# EAGLE design led projek (EAGLE 9.6.2)

## Sheet 1 of 2
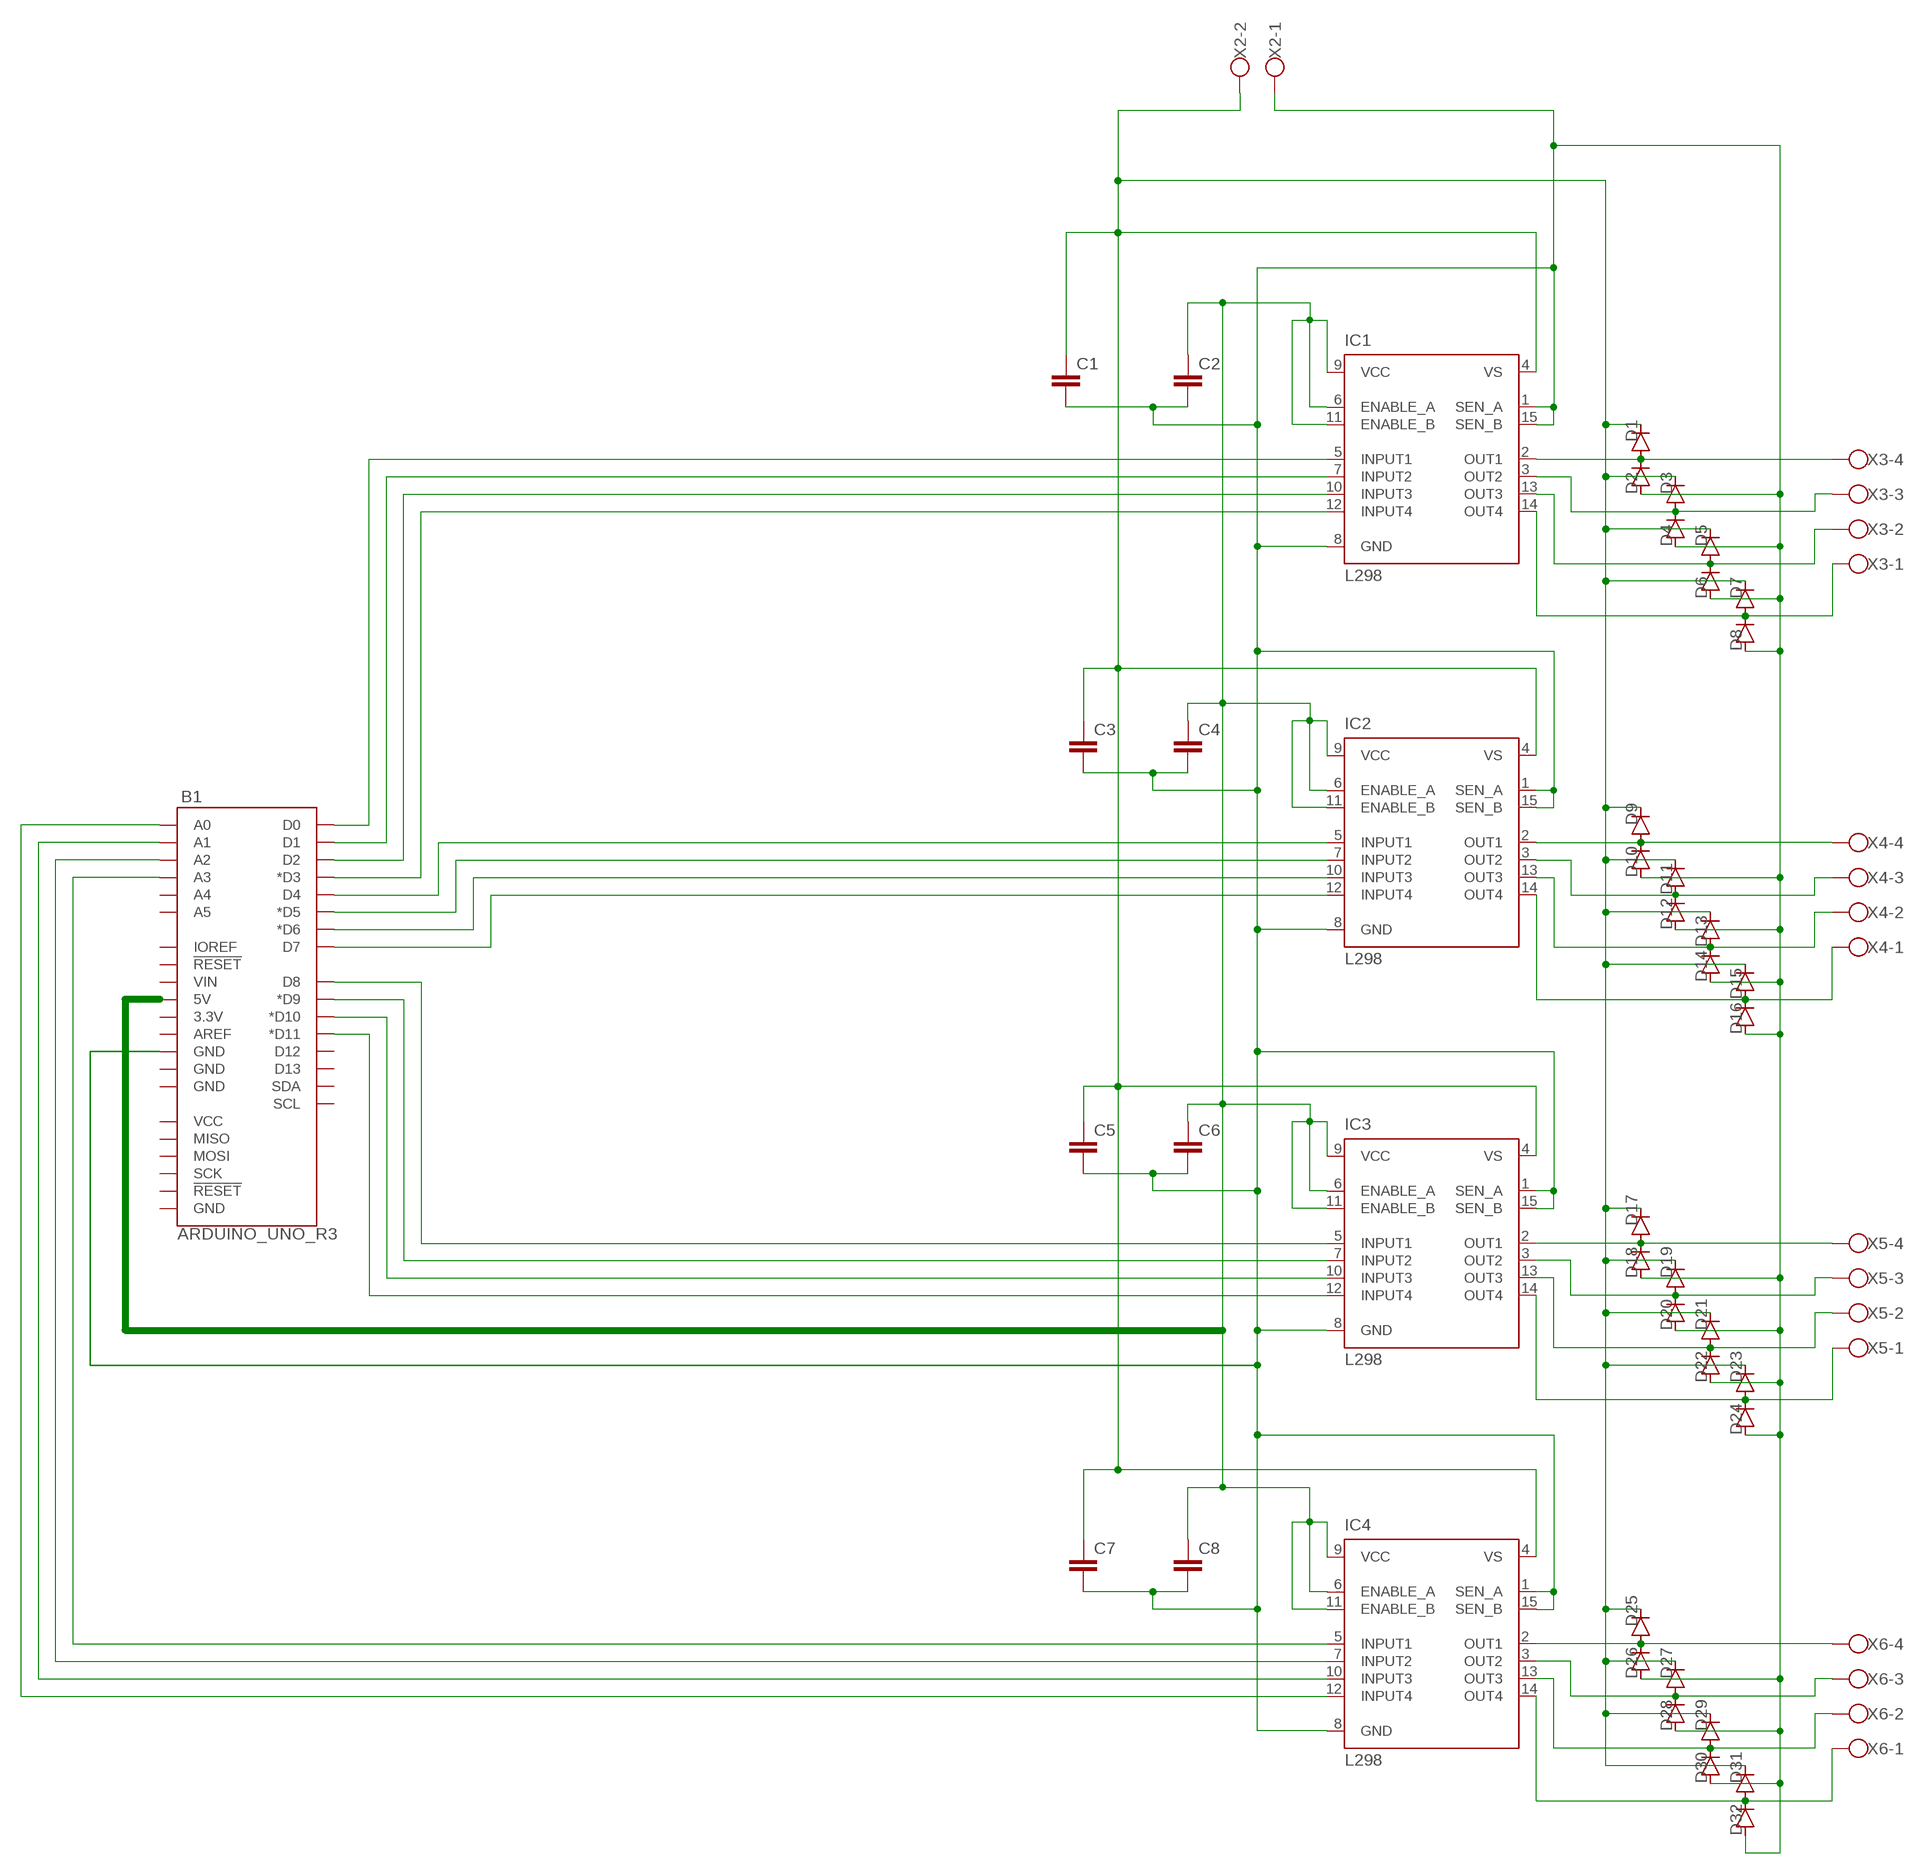
[diagram p0: schematic, sheet 1]

### Parts
B1  ARDUINO_UNO_R3  [ARDUINO_R3]
C1  C-EUC0805K  [C0805K]
C2  C-EUC0805K  [C0805K]
C3  C-EUC0805K  [C0805K]
C4  C-EUC0805K  [C0805K]
C5  C-EUC0805K  [C0805K]
C6  C-EUC0805K  [C0805K]
C7  C-EUC0805K  [C0805K]
C8  C-EUC0805K  [C0805K]
D1  DIODE-DO-214AC  [DO-214AC]
D2  DIODE-DO-214AC  [DO-214AC]
D3  DIODE-DO-214AC  [DO-214AC]
D4  DIODE-DO-214AC  [DO-214AC]
D5  DIODE-DO-214AC  [DO-214AC]
D6  DIODE-DO-214AC  [DO-214AC]
D7  DIODE-DO-214AC  [DO-214AC]
D8  DIODE-DO-214AC  [DO-214AC]
D9  DIODE-DO-214AC  [DO-214AC]
D10  DIODE-DO-214AC  [DO-214AC]
D11  DIODE-DO-214AC  [DO-214AC]
D12  DIODE-DO-214AC  [DO-214AC]
D13  DIODE-DO-214AC  [DO-214AC]
D14  DIODE-DO-214AC  [DO-214AC]
D15  DIODE-DO-214AC  [DO-214AC]
D16  DIODE-DO-214AC  [DO-214AC]
D17  DIODE-DO-214AC  [DO-214AC]
D18  DIODE-DO-214AC  [DO-214AC]
D19  DIODE-DO-214AC  [DO-214AC]
D20  DIODE-DO-214AC  [DO-214AC]
D21  DIODE-DO-214AC  [DO-214AC]
D22  DIODE-DO-214AC  [DO-214AC]
D23  DIODE-DO-214AC  [DO-214AC]
D24  DIODE-DO-214AC  [DO-214AC]
D25  DIODE-DO-214AC  [DO-214AC]
D26  DIODE-DO-214AC  [DO-214AC]
D27  DIODE-DO-214AC  [DO-214AC]
D28  DIODE-DO-214AC  [DO-214AC]
D29  DIODE-DO-214AC  [DO-214AC]
D30  DIODE-DO-214AC  [DO-214AC]
D31  DIODE-DO-214AC  [DO-214AC]
D32  DIODE-DO-214AC  [DO-214AC]
IC1  L298  [MULTIWATT-15]
IC2  L298  [MULTIWATT-15]
IC3  L298  [MULTIWATT-15]
IC4  L298  [MULTIWATT-15]
X2  W237-102  [W237-102]
X3  W237-4  [W237-4]
X4  W237-4  [W237-4]
X5  W237-4  [W237-4]
X6  W237-4  [W237-4]

### Nets
N$1: B1.D0 IC1.5(INPUT1)
N$2: B1.D1 IC1.7(INPUT2)
N$3: B1.D2 IC1.10(INPUT3)
N$4: B1.D3(*D3) IC1.12(INPUT4)
N$5: B1.D4 IC2.5(INPUT1)
N$6: B1.D5(*D5) IC2.7(INPUT2)
N$7: B1.D6(*D6) IC2.10(INPUT3)
N$8: B1.D7 IC2.12(INPUT4)
N$9: B1.D8 IC3.5(INPUT1)
N$10: B1.D9(*D9) IC3.7(INPUT2)
N$11: B1.D10(*D10) IC3.10(INPUT3)
N$12: B1.D11(*D11) IC3.12(INPUT4)
N$13: B1.A0 IC4.12(INPUT4)
N$14: B1.A1 IC4.10(INPUT3)
N$15: B1.A2 IC4.7(INPUT2)
N$16: B1.A3 IC4.5(INPUT1)
N$17: D3.A D4.C IC1.3(OUT2) X3.3
N$19: D11.A D12.C IC2.3(OUT2) X4.3
N$20: D5.A D6.C IC1.13(OUT3) X3.2
N$21: D7.A D8.C IC1.14(OUT4) X3.1
N$22: D9.A D10.C IC2.2(OUT1) X4.4
N$23: D13.A D14.C IC2.13(OUT3) X4.2
N$24: D15.A D16.C IC2.14(OUT4) X4.1
N$25: B1.GND@4(GND) C1.2 C2.2 C3.2 C4.2 C5.2 C6.2 C7.2 C8.2 D2.A D4.A D6.A D8.A D10.A D12.A D14.A D16.A D18.A D20.A D22.A D24.A D26.A D28.A D30.A D32.A IC1.1(SEN_A) IC1.8(GND) IC1.15(SEN_B) IC2.1(SEN_A) IC2.8(GND) IC2.15(SEN_B) IC3.1(SEN_A) IC3.8(GND) IC3.15(SEN_B) IC4.1(SEN_A) IC4.8(GND) IC4.15(SEN_B) X2.1
N$26: D25.A D26.C IC4.2(OUT1) X6.4
N$27: D27.A D28.C IC4.3(OUT2) X6.3
N$28: D29.A D30.C IC4.13(OUT3) X6.2
N$29: D17.A D18.C IC3.2(OUT1) X5.4
N$30: D19.A D20.C IC3.3(OUT2) X5.3
N$31: D21.A D22.C IC3.13(OUT3) X5.2
N$32: D31.A D32.C IC4.14(OUT4) X6.1
N$33: D23.A D24.C IC3.14(OUT4) X5.1
N$34: C1.1 C3.1 C5.1 C7.1 D1.C D3.C D5.C D7.C D9.C D11.C D13.C D15.C D17.C D19.C D21.C D23.C D25.C D27.C D29.C D31.C IC1.4(VS) IC2.4(VS) IC3.4(VS) IC4.4(VS) X2.2
N$45: D1.A D2.C IC1.2(OUT1) X3.4
N$57: B1.5V C2.1 C4.1 C6.1 C8.1 IC1.6(ENABLE_A) IC1.9(VCC) IC1.11(ENABLE_B) IC2.6(ENABLE_A) IC2.9(VCC) IC2.11(ENABLE_B) IC3.6(ENABLE_A) IC3.9(VCC) IC3.11(ENABLE_B) IC4.6(ENABLE_A) IC4.9(VCC) IC4.11(ENABLE_B)
Unconnected: B1.3.3V B1.A4 B1.A5 B1.AREF B1.D12 B1.D13 B1.GND@1(GND) B1.GND@2(GND) B1.GND@3(GND) B1.IOREF B1.MISO B1.MOSI B1.RESET@1(!RESET!) B1.RESET@2(!RESET!) B1.SCK B1.SCL B1.SDA B1.VCC B1.VIN

## Sheet 2 of 2

## Library data of the parts
B1 = SparkFun-Boards:ARDUINO_UNO_R3: Arduino R3 Footprint with SPI header Arduino Uno R3 Compatible Footprint. Matches PCB size of the original board. SparkFun Products: SAMD21 Dev Breakout <https://www.sparkfun.com/products/13672> RedBoard <https://www.sparkfun.com/products/12757> R3 Stackable Headers <https://www.sparkfun.com/products/11417>
C1-C8 = rcl:C-EU: CAPACITOR, European symbol; SPICEPREFIX: C
D1-D32 = diode:DIODE-: DIODE
IC1-IC4 = st-microelectronics:L298: DUAL FULL-BRIDGE DRIVER; MPN: L298N; OC_FARNELL: 1589425; OC_NEWARK: 32M1527
X2 = con-wago-500:W237-102: WAGO SCREW CLAMP; MPN: 237-102; OC_FARNELL: unknown; OC_NEWARK: 70K9898
X3-X6 = con-wago-500:W237-4: WAGO SCREW CLAMP; OC_FARNELL: unknown; OC_NEWARK: unknown

## Board
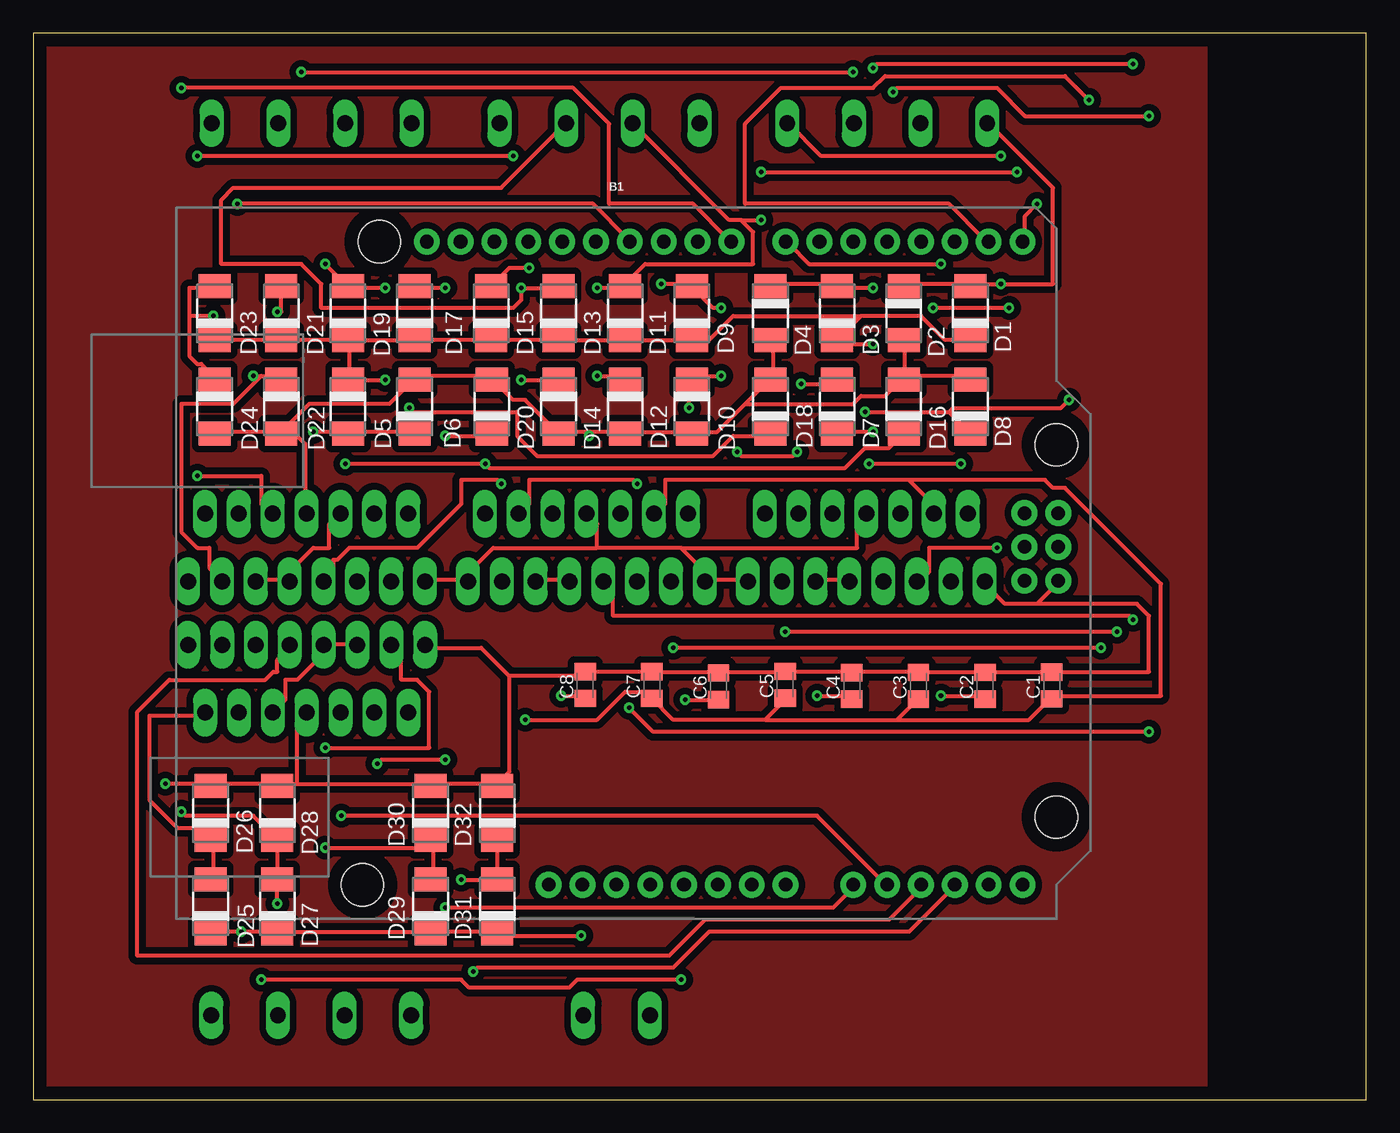
[diagram p1: board, top side]
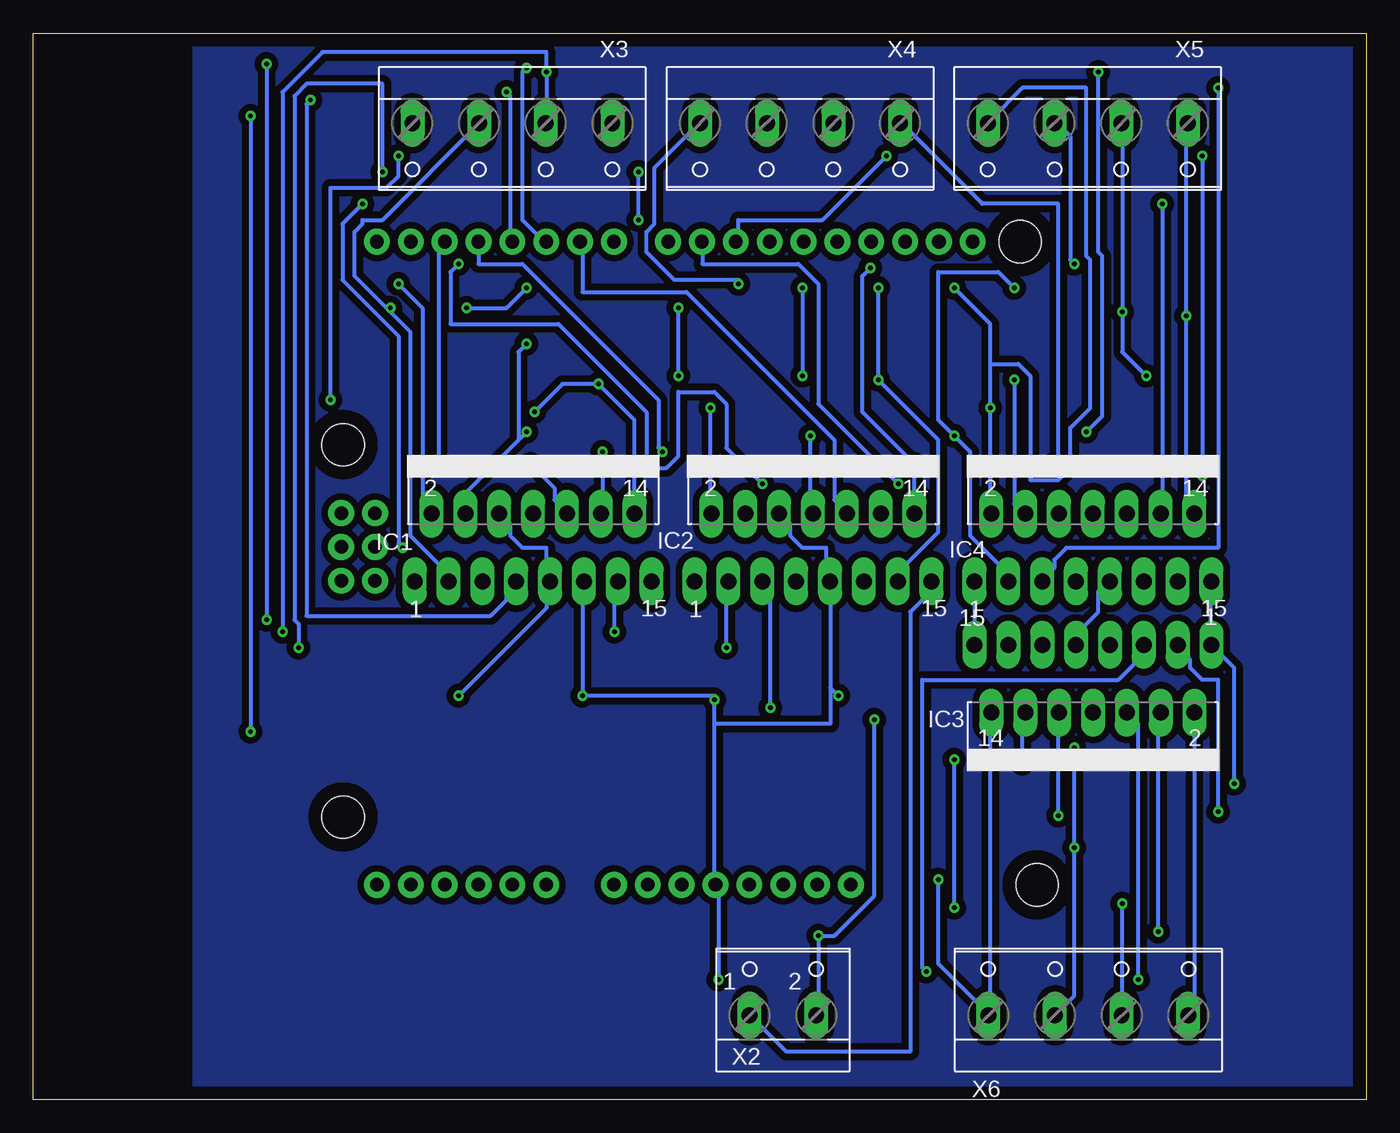
[diagram p2: board, bottom side, seen from below]

Size 100 x 80 mm. Coordinates in mm from the lower left corner, seen from the top.
Outline: 0,0 100,0 100,80 0,80 0,0
Copper layers (1*16): Top 0.035mm / dielectric 1.5mm / Bottom 0.035mm
Design rules "default *": minimum track width 0.3mm, minimum drill 0.35mm, track to track 0.5mm, track to pad 0.5mm, pad to pad 0.5mm, via to via 0.5mm, smd to smd 0.5mm, copper to edge 1mm, drill to drill 1mm, minimum pad ring 10mil, minimum via ring 8mil, stop-mask expansion 4mil, vias tented up to drill 0mil, thermal gap 1mm

### Footprints (pad centres in the part's own frame; a part is rotated, then mirrored left to right if it is on the bottom)
ARDUINO_R3 = drill 1.016 pad 1.93: 3.3V 2.54,-24.13; 5V 5.08,-24.13; A0 17.78,-24.13; A1 20.32,-24.13; A2 22.86,-24.13; A3 25.4,-24.13; A4 27.94,-24.13; A5 30.48,-24.13; AREF -9.144,24.13; D0 30.48,24.13; D1 27.94,24.13; D2 25.4,24.13; D3 22.86,24.13; D4 20.32,24.13; D5 17.78,24.13; D6 15.24,24.13; D7 12.7,24.13; D8 8.636,24.13; D9 6.096,24.13; D10 3.556,24.13; D11 1.016,24.13; D12 -1.524,24.13; D13 -4.064,24.13; GND@1 7.62,-24.13; GND@2 10.16,-24.13; GND@3 -6.604,24.13; GND@4 33.16,-1.32; IOREF -2.54,-24.13; MISO 30.62,3.76; MOSI 33.16,1.22; NC -5.08,-24.13; RESET@1 0,-24.13; RESET@2 30.62,-1.32; SCK 30.62,1.22; SCL -14.224,24.13; SDA -11.684,24.13; VCC 33.16,3.76; VIN 12.7,-24.13 | hole 3.175: -17.78,24.13; 33.02,8.89; 33.02,-19.05; -19.05,-24.13
C0805K = smd 1.3 x 1.6: 1 -1,0; 2 1,0
DO-214AC = smd 1.8 x 2.4: A 2.025,0; C -2.025,0
MULTIWATT-15 = drill 1.2 long: 1 -8.89,-7.62; 2 -7.62,-2.54; 3 -6.35,-7.62; 4 -5.08,-2.54; 5 -3.81,-7.62; 6 -2.54,-2.54; 7 -1.27,-7.62; 8 0,-2.54; 9 1.27,-7.62; 10 2.54,-2.54; 11 3.81,-7.62; 12 5.08,-2.54; 13 6.35,-7.62; 14 7.62,-2.54; 15 8.89,-7.62
W237-102 = drill 1.194 long: 1 -2.5,-1.27; 2 2.5,-1.27
W237-4 = drill 1.194 long: 1 -7.5,-1.27; 2 -2.5,-1.27; 3 2.5,-1.27; 4 7.5,-1.27

### Placement (x,y rotation side)
B1  43.74,40.24 0 top
C1  76.4,31.06 90 top
C2  71.4,31.05 90 top
C3  66.4,31.04 90 top
C4  61.4,31.03 90 top
C5  56.4,31.12 90 top
C6  51.4,31.01 90 top
C7  46.4,31.1 90 top
C8  41.4,31.09 90 top
D1  70.3,59 90 top
D2  65.3,59 270 top
D3  60.3,59 90 top
D4  55.31,59 270 top
D5  23.6,52 270 top
D6  28.6,52 90 top
D7  60.3,52 90 top
D8  70.3,52 90 top
D9  49.4,59 90 top
D10  49.4,52 270 top
D11  44.4,59 90 top
D12  44.4,52 270 top
D13  39.4,59 90 top
D14  39.4,52 270 top
D15  34.35,59 90 top
D16  65.3,52 90 top
D17  28.6,59 90 top
D18  55.3,52 90 top
D19  23.6,59 90 top
D20  34.4,52 90 top
D21  18.6,59 90 top
D22  18.6,52 270 top
D23  13.6,59 90 top
D24  13.6,52 270 top
D25  13.3,14.5 90 top
D26  13.3,21.5 90 top
D27  18.3,14.5 90 top
D28  18.3,21.5 90 top
D29  29.8,14.5 90 top
D30  29.8,21.5 90 top
D31  34.8,14.5 90 top
D32  34.8,21.5 90 top
IC1  62.5,46.5 0 bottom
IC2  41.5,46.5 0 bottom
IC3  20.5,46.5 0 bottom
IC4  20.5,26.5 180 bottom
X2  43.76,7.59 0 bottom
X3  64.06,71.99 180 bottom
X4  42.47,71.99 180 bottom
X5  20.88,71.99 180 bottom
X6  20.85,7.59 0 bottom

### Tracks (layer width: path | path; a pad name or v marks a point on that pad's centre or on a via)
GND
  pour Top: 0,80 88,80 88,0 0,0
  pour Bottom: 0,80 88,80 88,0 0,0
N$1  (via drill 0.35)
  Top 0.3: v72.3,41.4 67.2,41.4 67.2,39.6 66.6,39 IC1.5 | v75.3,67.2 74.4,66.3 74.4,64.5 B1.D0
  Bottom 0.3: v72.3,41.4 72.6,41.7 72.6,57.3 76.8,61.5 76.8,65.7 v75.3,67.2
N$2  (via drill 0.35)
  Top 0.3: v79.2,75 77.4,76.8 63.9,76.8 63,75.9 56.1,75.9 53.4,73.2 53.4,67.2 68.7,67.2 71.4,64.5 B1.D1
  Bottom 0.3: v79.2,75 79.5,74.7 79.5,36.3 65.7,36.3 64.5,37.5 64.5,38.1 63.9,38.7 IC1.7
N$3  (via drill 0.35)
  Top 0.3: v69.6,47.7 v62.7,47.7
  Bottom 0.3: v62.7,47.7 60.9,45.9 60.9,45 60,44.1 IC1.10 | v69.6,47.7 69.6,63.9 69.3,64.2 B1.D2
N$4  (via drill 0.35)
  Top 0.3: v57.3,48.6 57,48.3 53.1,48.3 v52.8,48.6
  Bottom 0.3: v57.3,48.6 57.3,44.1 IC1.12 | v52.8,48.6 53.1,48.9 53.1,52.5 63.3,62.7 66.6,62.7 B1.D3
N$5  (via drill 0.35)
  Top 0.3: v44.7,29.4 46.5,27.6 v83.7,27.6 | v83.7,73.8 74.4,73.8 72.3,75.9 64.8,75.9 v64.5,75.6
  Bottom 0.3: v44.7,29.4 44.7,38.1 45.3,38.7 IC2.5 | v83.7,73.8 v83.7,27.6 | v64.5,75.6 64.2,75.3 64.2,64.5 B1.D4
N$6  (via drill 0.35)
  Top 0.3: v82.5,36 82.2,36.3 43.5,36.3 43.5,38.1 42.9,38.7 IC2.7 | v82.5,77.7 63.3,77.7 v63,77.4
  Bottom 0.3: v82.5,77.7 v82.5,36 | v63,77.4 63.3,77.1 63.3,66 61.8,64.5 B1.D5
N$7
  Bottom 0.3: IC2.10 39,44.1 39.9,45 39.9,49.5 51,60.6 58.8,60.6 58.8,64.2 B1.D6
N$8  (via drill 0.35)
  Top 0.3: v45.3,46.2 45,46.5 37.2,46.5 37.2,44.7 36.6,44.1 IC2.12 | v68.1,62.7 58.2,62.7 56.7,64.2 B1.D7
  Bottom 0.3: v45.3,46.2 48,48.9 48,52.2 48.9,53.1 51.6,53.1 51.6,48.3 52.5,47.4 54,47.4 54,51.6 60.6,58.2 68.7,58.2 68.7,62.1 v68.1,62.7
N$9  (via drill 0.35)
  Top 0.3: v11.1,75.9 40.5,75.9 43.2,73.2 43.2,67.2 49.5,67.2 52.2,64.5 B1.D8
  Bottom 0.3: v11.1,75.9 11.1,41.4 22.5,41.4 23.4,40.5 23.4,39.9 24.3,39 IC3.5
N$10  (via drill 0.35)
  Top 0.3: v35.1,46.2 34.8,46.5 32.1,46.5 32.1,44.7 28.8,41.4 23.7,41.4 22.8,40.5 22.5,40.5 22.5,39.6 21.9,39 IC3.7
  Bottom 0.3: v35.1,46.2 41.1,52.2 41.1,61.2 42.6,62.7 49.8,62.7 49.8,64.2 B1.D9
N$11  (via drill 0.35)
  Top 0.3: v12.3,46.8 17.1,46.8 17.1,44.7 17.7,44.1 IC3.10 | v36,70.8 v12.3,70.8
  Bottom 0.3: v12.3,70.8 v12.3,46.8 | v36,70.8 40.8,66 47.1,66 47.1,64.5 B1.D10
N$12  (via drill 0.35)
  Top 0.3: v15.3,67.2 42,67.2 44.7,64.5 B1.D11
  Bottom 0.3: v15.3,67.2 15.3,44.1 IC3.12
N$13  (via drill 0.35)
  Top 0.3: v25.8,25.2 26.1,25.5 v30.9,25.5 | v30.9,14.4 60,14.4 61.5,15.9 B1.A0
  Bottom 0.3: v25.8,25.2 25.8,28.8 IC4.12 | v30.9,14.4 v30.9,25.5
N$14  (via drill 0.35)
  Top 0.3: v23.1,21.3 58.8,21.3 63.9,16.2 B1.A1
  Bottom 0.3: v23.1,21.3 23.1,28.8 IC4.10
N$15
  Top 0.3: IC4.7 19.2,33.9 18.3,33 18.3,32.1 18,32.1 17.4,31.5 10.2,31.5 7.8,29.1 7.8,10.8 47.7,10.8 50.4,13.5 64.2,13.5 66.6,15.9 B1.A2
N$16  (via drill 0.35)
  Top 0.3: v33,9.6 33.3,9.9 48,9.9 50.7,12.6 65.7,12.6 69,15.9 B1.A3
  Bottom 0.3: v33,9.6 33.3,9.9 33.3,31.5 18.6,31.5 17.4,32.7 17.4,33.3 16.8,33.9 IC4.5
N$17  (via drill 0.35)
  Top 0.3: D4.C 55.5,61.2 60.3,61.2 D3.A 60.3,60.9 v63,60.9 | v73.2,59.4 v67.5,59.4
  Bottom 0.3: 73.2,59.1 71.7,57.6 71.7,42.3 69,39.6 69,39 IC1.3 | 73.2,59.1 75.9,61.8 75.9,65.1 75.3,65.7 75.3,66 73.8,66 66.6,73.2 X3.3 | v63,60.9 64.5,59.4 v67.5,59.4 | 73.2,59.1 v73.2,59.4
N$19  (via drill 0.35)
  Top 0.3: v42.3,54.3 44.4,54.3 D12.C | v42.3,60.9 44.4,60.9 D11.A 44.4,61.2 45.9,62.7 54,62.7 54,65.1 53.1,66 | 53.1,66 52.2,66 45,73.2 X4.3 | v80.1,33.9 v48,33.9 | v54.6,69.6 v73.8,69.6 | 53.1,66 v54.6,66
  Bottom 0.3: v42.3,60.9 v42.3,54.3 | v48,33.9 48,38.7 IC2.3 | v80.1,33.9 80.1,35.7 80.4,36 80.4,75.3 79.5,76.2 73.8,76.2 v73.8,69.6 | v54.6,66 v54.6,69.6
N$20  (via drill 0.35)
  Top 0.3: D6.C 28.5,50.1 23.7,50.1 D5.A 23.4,50.1 v21,50.1 | v20.1,77.1 v61.5,77.1 | v81.3,35.1 v56.4,35.1
  Bottom 0.3: v20.1,77.1 20.1,63.6 19.8,63.3 19.8,51.3 v21,50.1 | X3.2 61.5,73.5 v61.5,77.1 61.5,78.6 78.3,78.6 81.3,75.6 v81.3,35.1 | v56.4,35.1 56.4,38.7 IC1.13
N$21  (via drill 0.35)
  Top 0.3: v57.6,53.7 60,53.7 60.3,54 D7.A | 68.7,51.6 70.2,50.1 D8.C | v62.4,51.6 68.7,51.6 | v72.6,70.8 59.1,70.8 56.7,73.2 X3.1 | v77.7,52.5 77.1,51.9 69,51.9 68.7,51.6
  Bottom 0.3: IC1.14 54.9,44.1 54.9,51 v57.6,53.7 60.3,53.7 v62.4,51.6 | v72.6,70.8 72.6,69.3 73.5,68.4 77.7,68.4 v77.7,52.5
N$22  (via drill 0.35)
  Top 0.3: v49.2,51.9 49.2,54 D10.C 49.5,54.3 v51.6,54.3 | v51.6,59.4 51,59.4 49.5,60.9 D9.A 49.2,61.2 v47.1,61.2
  Bottom 0.3: v49.2,51.9 49.2,44.1 IC2.2 | v51.6,54.3 v51.6,59.4 | v47.1,61.2 47.1,61.5 51.9,61.5 54,63.6 54,65.1 53.4,65.7 53.4,69.9 50.1,73.2 X4.4
N$23  (via drill 0.35)
  Top 0.3: v36.6,54 39.3,54 D14.C | D13.A 39.3,60.9 v36.6,60.9 36.6,60 36,59.4 21.6,59.4 21.6,61.2 20.1,62.7 14.1,62.7 14.1,67.5 15,68.4 35.1,68.4 39.9,73.2 X4.2
  Bottom 0.3: IC2.13 35.1,39 35.1,39.6 32.1,42.6 32.1,49.5 v36.6,54 v36.6,60.9
N$24  (via drill 0.35)
  Top 0.3: D16.C 65.1,49.8 64.2,48.9 62.4,48.9 60.9,47.4 34.2,47.4 v33.9,47.7 v23.4,47.7 | v37.2,62.4 35.7,62.4 34.5,61.2 D15.A
  Bottom 0.3: IC2.14 33.9,44.1 v33.9,47.7 37.8,51.6 37.8,61.8 v37.2,62.4 | v23.4,47.7 23.1,48 23.1,67.2 28.8,67.2 34.8,73.2 X4.1
N$25  (via drill 0.35)
  Top 0.3: 34.8,23.7 30,23.7 D30.A 29.7,23.7 19.8,23.7 | 18.3,23.7 13.5,23.7 D26.A 13.2,23.7 v9.9,23.7 | 19.8,23.7 19.8,28.2 20.4,28.8 IC4.8 | 18.3,23.7 19.8,23.7 | 18.3,23.7 D28.A | 56.4,32.1 51.6,32.1 C6.2 51.3,32.1 C7.2 C8.2 41.4,31.8 35.7,31.8 | 75.3,37.2 72.9,37.2 71.4,38.7 IC1.1 | 75.3,37.2 76.8,38.7 B1.GND@4 | 71.4,32.1 66.6,32.1 C3.2 66.3,32.1 61.5,32.1 C4.2 61.2,32.1 56.4,32.1 | 71.4,32.1 76.2,32.1 C1.2 76.5,32.1 83.7,32.1 83.7,36.3 82.8,37.2 75.3,37.2 | 71.4,32.1 C2.2 | 56.4,32.1 C5.2 | 34.8,23.7 35.7,24.6 35.7,31.8 | 34.8,23.7 D32.A | 18.6,50.1 13.8,50.1 D24.A | IC3.8 20.4,44.1 20.4,49.2 19.8,49.8 18.6,49.8 D22.A 18.6,50.1 | 65.4,54.3 70.2,54.3 D8.A | 65.4,54.3 65.4,56.7 D2.A | 65.4,54.3 D16.A 65.1,54 63.9,52.8 62.1,52.8 61.5,52.2 53.4,52.2 | D4.A 55.5,56.7 55.5,54.3 D18.A 55.2,54 53.4,52.2 | 44.4,50.1 41.7,50.1 | 41.7,50.1 39.6,50.1 D14.A 39.3,50.1 36.9,52.5 36,52.5 34.5,54 D20.A 34.2,54.3 28.8,54.3 D6.A 28.5,54 26.7,52.2 20.7,52.2 18.6,50.1 | 44.4,50.1 49.2,50.1 D10.A 49.5,50.1 51.3,50.1 53.4,52.2 | 44.4,50.1 D12.A | IC1.15 53.4,39 50.4,39 IC2.1 50.1,39 50.1,39.9 48.6,41.4 | 42.3,41.4 42.3,43.2 41.7,43.8 IC2.8 | 48.6,41.4 42.3,41.4 | 48.6,41.4 61.8,41.4 61.8,43.2 62.4,43.8 IC1.8 | 32.1,39 32.4,39 IC2.15 32.1,39 | 32.1,39 29.4,39 IC3.1 | 42.3,41.4 34.5,41.4 32.1,39 | v41.7,49.8 41.7,50.1 | 35.7,31.8 33.6,33.9 29.4,33.9 IC4.15
  Bottom 0.3: IC3.15 11.7,38.7 11.7,34.2 IC4.1 11.4,33.9 9.9,32.4 v9.9,23.7 | IC4.15 29.4,34.2 29.4,38.7 IC3.1 | X2.1 46.2,6.3 43.5,3.6 34.2,3.6 34.2,36.6 32.7,38.1 32.7,38.7 IC2.15 | v41.7,49.8 41.7,44.1 IC2.8
N$26
  Top 0.3: D25.A 13.5,16.8 13.5,19.2 D26.C 13.2,19.5 12.3,20.4 10.8,20.4 8.7,22.5 8.7,28.8 12.6,28.8 IC4.2
  Bottom 0.3: X6.4 13.2,6.6 12.9,6.9 12.9,28.8 IC4.2
N$27  (via drill 0.35)
  Top 0.3: v18.3,14.7 D27.A D28.C 18.3,19.5 16.5,21.3 11.4,21.3 v11.1,21.6
  Bottom 0.3: v18.3,14.7 18.3,6.6 X6.3 | v11.1,21.6 11.1,31.5 12.3,31.5 13.2,32.4 13.2,33 14.1,33.9 IC4.3
N$28  (via drill 0.35)
  Top 0.3: 30,18.9 30,19.2 D30.C 30,18.9 | 30,18.9 30,16.8 D29.A | v21.9,18.9 30,18.9 | v21.9,26.4 29.7,26.4 29.7,30.6 28.8,31.5 27.6,31.5 27.6,33.3 27,33.9 IC4.13
  Bottom 0.3: X6.2 23.1,6.6 21.9,7.8 v21.9,18.9 v21.9,26.4
N$29  (via drill 0.35)
  Top 0.3: v30.9,60.9 28.8,60.9 D17.A | v28.2,51.9 28.5,51.6 36.3,51.6 36.3,49.8 37.8,48.3 51,48.3 52.5,49.8 55.2,49.8 D18.C
  Bottom 0.3: v30.9,60.9 28.2,58.2 28.2,55.2 | 28.2,55.2 v28.2,51.9 28.2,44.1 IC3.2 | 28.2,55.2 26.1,55.2 25.2,54.3 25.2,46.5 23.1,46.5 22.2,47.4 22.2,50.4 20.7,51.9 20.7,63 21,63.3 21,75.9 25.8,75.9 28.2,73.5 X5.4
N$30  (via drill 0.35)
  Top 0.3: v21.9,62.7 23.4,61.2 D19.A 23.7,60.9 v26.4,60.9 | v30.9,49.8 34.2,49.8 D20.C
  Bottom 0.3: v21.9,62.7 22.2,63 22.2,72.3 23.1,73.2 X5.3 | IC3.3 27,39 27,39.6 29.7,42.3 29.7,48.6 v30.9,49.8 32.1,51 32.1,62.1 27.6,62.1 v26.4,60.9
N$31  (via drill 0.35)
  Top 0.3: v16.5,54.3 17.1,54.3 | 17.1,54.3 18.6,54.3 D22.C | D21.A 18.6,59.1 v18.3,59.1 | 17.1,54.3 15,52.2 11.1,52.2 11.1,42.6 12.3,41.4 13.2,41.4 13.2,39.9 14.1,39 IC3.13
  Bottom 0.3: v16.5,54.3 18.3,56.1 v18.3,59.1 18.3,73.2 X5.2
N$32  (via drill 0.35)
  Top 0.3: D32.C D31.A 34.8,16.5 v32.1,16.5
  Bottom 0.3: v32.1,16.5 32.1,10.2 28.5,6.6 X6.1 28.2,6.6 28.2,28.8 IC4.14
N$33  (via drill 0.35)
  Top 0.3: 11.7,58.8 11.7,60.9 13.5,60.9 D23.A | 11.7,58.8 11.7,55.8 12.3,55.2 12.6,55.2 13.5,54.3 D24.C | v13.5,58.8 11.7,58.8
  Bottom 0.3: X5.1 13.5,73.2 v13.5,58.8 13.5,44.7 12.9,44.1 IC3.14
N$34  (via drill 0.35)
  Top 0.3: v63,50.1 60.3,50.1 D7.C | 65.7,46.5 47.4,46.5 47.4,44.7 46.8,44.1 IC2.4 | 65.7,46.5 67.5,44.7 67.5,44.1 IC1.4 | 18.6,57 13.8,57 D23.C | D19.C 23.7,56.7 23.7,54.3 D5.C 23.7,54 v26.4,54 | D19.C 23.7,57 28.5,57 D17.C 28.8,57 34.2,57 D15.C 34.5,57 39.3,57 D13.C 39.6,57 44.4,57 | 18.6,57 23.4,57 D19.C | 18.6,57 D21.C | 62.1,58.8 60.3,57 D3.C 60.3,56.7 v63,56.7 | 62.1,58.8 66.6,58.8 68.4,57 70.2,57 D1.C | 44.4,57 49.2,57 D9.C 49.5,57 50.7,57 52.5,58.8 62.1,58.8 | 44.4,57 D11.C | 54.9,28.5 48,28.5 C7.1 45.9,30.6 44.4,30.6 42.3,28.5 v36.9,28.5 | 54.9,28.5 56.4,30 C5.1 | 64.8,28.5 66.3,30 C3.1 | 54.9,28.5 64.8,28.5 | 64.8,28.5 74.7,28.5 76.2,30 C1.1 76.5,30.3 84.6,30.3 84.6,38.7 77.4,45.9 76.5,45.9 75.9,46.5 65.7,46.5 | v41.1,12.3 34.8,12.3 D31.C 34.8,12.6 30,12.6 D29.C 29.7,12.6 18.3,12.6 | 18.3,12.6 v15.6,12.6 13.5,12.6 D25.C | 18.3,12.6 D27.C
  Bottom 0.3: 63.6,49.5 67.5,45.6 67.5,44.1 IC1.4 | 63.6,49.5 v63,50.1 | v26.4,54 26.4,44.7 25.8,44.1 IC3.4 | 63.6,49.5 63.6,56.1 v63,56.7 | X2.2 41.1,6.6 v41.1,12.3 39.9,12.3 36.9,15.3 v36.9,28.5 | v15.6,12.6 15.6,28.8 IC4.4
N$45  (via drill 0.35)
  Top 0.3: D2.C 65.4,61.2 70.2,61.2 D1.A 70.5,61.2 v72.6,61.2 76.5,61.2 76.5,68.4 71.7,73.2 X3.4
  Bottom 0.3: v72.6,61.2 70.8,59.4 70.8,44.7 70.2,44.1 IC1.2
N$57  (via drill 0.35)
  Top 0.3: v58.8,30.3 61.2,30.3 C4.1 | v68.1,30.3 71.4,30.3 C2.1 | IC1.11 58.8,39 61.2,39 IC1.9 | IC3.11 16.8,39 19.2,39 IC3.9 19.5,39 19.5,39.9 21,41.4 22.2,41.4 22.2,43.2 22.8,43.8 IC3.6 | IC4.6 18,29.1 18.9,30 18.9,31.5 19.8,31.5 21.6,33.3 21.6,33.9 IC4.9 21.9,34.2 24.3,34.2 IC4.11 | v48.9,30 51.3,30 C6.1 | v39.6,30.3 41.4,30.3 C8.1 | IC2.11 37.8,39 40.2,39 IC2.9 | v17.1,9 32.1,9 32.7,8.4 40.2,8.4 40.8,9 v48.6,9
  Bottom 0.3: IC1.11 58.8,38.7 v58.8,30.3 48.9,30.3 v48.9,30 48.9,28.2 | v68.1,30.3 61.5,36.9 61.5,38.7 IC1.9 61.5,39 61.5,41.4 63.3,41.4 64.2,42.3 64.2,43.2 64.8,43.8 IC1.6 | IC3.9 19.5,38.7 20.1,38.1 20.1,36.6 21.6,35.1 21.6,34.2 IC4.9 | 48.9,28.2 48.9,16.2 B1.5V 48.6,15.9 v48.6,9 | 40.2,30.9 v39.6,30.3 | 40.2,30.9 40.2,38.7 IC2.9 40.5,39 40.5,41.4 42.3,41.4 43.2,42.3 43.2,43.2 43.8,43.8 IC2.6 | 48.9,28.2 40.2,28.2 40.2,30.9 | v17.1,9 17.1,28.2 17.7,28.8 IC4.6